# EAGLE schematic gdo_v7 (EAGLE 9.5.2)
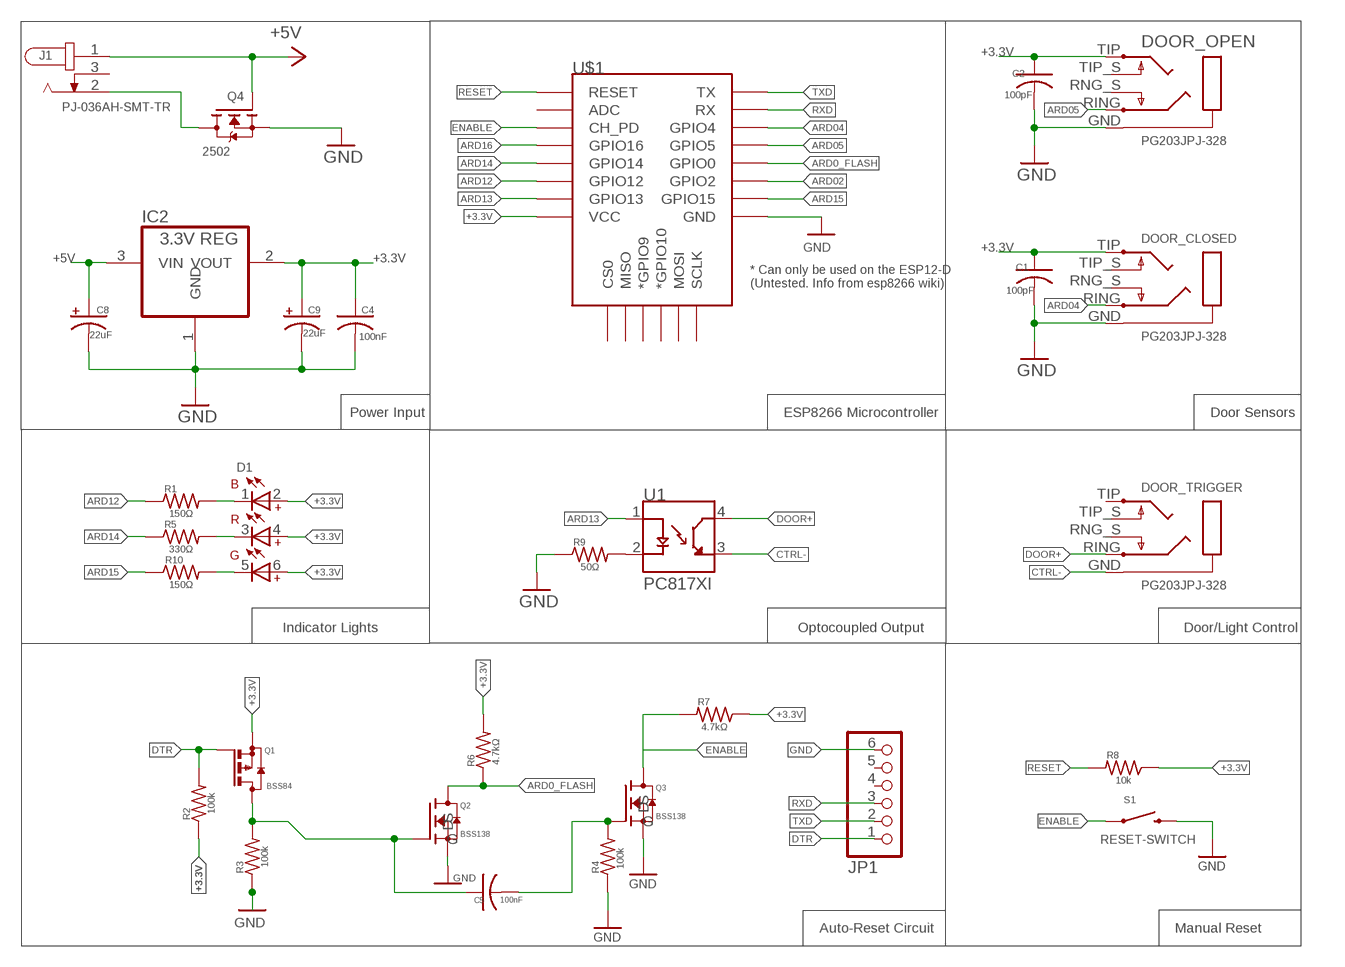
[diagram p0: schematic, sheet 1]

## Parts
C1  100pF  C-USC0805  [C0805]
C2  100pF  C-USC0805  [C0805]
C4  100nF  C-USC0805  [C0805]
C5  100nF  C-USC0805  [C0805]
C8  22uF  10UF-TANT  [EIA3216]
C9  22uF  10UF-TANT  [EIA3216]
D1  WL-SFTW_5050_PLCC6_150505M173300  [WL-SFTW_5050_PLCC6]
DOOR_CLOSED  PG203JPJ-328  [PG203J]
DOOR_OPEN  PG203JPJ-328  [PG203J]
DOOR_TRIGGER  PG203JPJ-328  [PG203J]
IC2  3.3V REG  REG1117  [SOT223]
J1  PJ-036AH-SMT-TR  [CUI_PJ-036AH-SMT-TR]
JP1  PINHD-1X6  [1X06]
Q1  BSS84  [SOT23]
Q2  BSS138  [BSS138]
Q3  BSS138  [BSS138]
Q4  2502  BSS138  [SOT23]
R1  150Ω  R-US_R0805  [R0805]
R2  100k  R-US_R0805  [R0805]
R3  100k  R-US_R0805  [R0805]
R4  100k  R-US_R0805  [R0805]
R5  330Ω  R-US_R0805  [R0805]
R6  4.7kΩ  R-US_R0805  [R0805]
R7  4.7kΩ  R-US_R0805  [R0805]
R8  10k  R-US_R0805  [R0805]
R9  50Ω  R-US_R0805  [R0805]
R10  150Ω  R-US_R0805  [R0805]
S1  RESET-SWITCH  SWITCH-MOMENTARY-2-SMD-1101NE  [TACTILE-SWITCH-1101NE]
U1  PC817XI  [SOIC254P975X460-4N]
U$1  ESP12ESMD  [ESP12E-SMD]

## Nets
+3.3V: C1.1 C2.1 C4.1 C9.A(+) D1.2 D1.4 D1.6 DOOR_CLOSED.TIP DOOR_OPEN.TIP IC2.2(VOUT) Q1.2(S) R2.1 R6.2 R7.1 R8.1 U$1.VCC
+5V: C8.A(+) IC2.3(VIN) J1.1 Q4.1(G)
ARD0_FLASH: Q2.D R6.1 U$1.GPIO0
ARD02: U$1.GPIO2
ARD04: DOOR_CLOSED.RING U$1.GPIO4
ARD05: DOOR_OPEN.RING U$1.GPIO5
ARD12: R1.1 U$1.GPIO12
ARD13: U1.1(A) U$1.GPIO13
ARD14: R5.1 U$1.GPIO14
ARD15: R10.1 U$1.GPIO15
ARD16: U$1.GPIO16
CTRL-: DOOR_TRIGGER.GND U1.3(ET)
DOOR+: DOOR_TRIGGER.RING U1.4(CT)
DTR: JP1.1 Q1.1(G) R2.2
ENABLE: Q3.D R7.2 S1.P$1 U$1.CH_PD
GND: C1.2 C2.2 C4.2 C8.C(-) C9.C(-) DOOR_CLOSED.GND DOOR_OPEN.GND IC2.1(GND) JP1.6 Q2.S Q3.S Q4.2(S) R3.1 R4.1 R9.1 S1.P$2 U$1.GND
N$1: J1.2 Q4.3(D)
N$2: C5.2 Q3.G R4.2
N$3: D1.1 R1.2
N$4: D1.3 R5.2
N$5: C5.1 Q1.3(D) Q2.G R3.2
N$6: R9.2 U1.2(C)
N$7: D1.5 R10.2
RESET: R8.2 U$1.RESET
RXD: JP1.3 U$1.RXD0(RX)
TXD: JP1.2 U$1.TXD0(TX)
Unconnected: DOOR_CLOSED.RNG_S DOOR_CLOSED.TIP_S DOOR_OPEN.RNG_S DOOR_OPEN.TIP_S DOOR_TRIGGER.RNG_S DOOR_TRIGGER.TIP DOOR_TRIGGER.TIP_S J1.3 JP1.4 JP1.5 U$1.ADC U$1.CS0 U$1.GPIO9(*GPIO9) U$1.GPIO10(*GPIO10) U$1.MISO U$1.MOSI U$1.SCLK

## Notes on the sheet
- Power Input | ESP8266 Microcontroller | Door Sensors
- Indicator Lights | Optocoupled Output | Door/Light Control
- Auto-Reset Circuit | Manual Reset

## Library data of the parts
C1 C2 C4 C5 = resistor:C-US: CAPACITOR, American symbol
C8 C9 = SparkFun-Capacitors:10UF-TANT: 10uF Tantalum SMT CAP-00811- 16V 10% (EIA-3216); PROD_ID: CAP-00811; VALUE: 10uF
D1 = Eagle_WL-SFTW_rev19c:WL-SFTW_5050_PLCC6: WL-SFTW SMD Full-color TOP LED Waterclear Characteristics PLCC 4, PLCC 6 Low energy consumption High reliability Low current requirement Fast switching No UV/IR radiation High brightness RGB individual control Compact package outline PLCC 4: black surface PLCC 6: white surface Applications PLCC 4: Size 3528 Flash light, switch indicators, equipments indicators, accent and decorative lighting, electronic signage, video displays, backlight for LCDs, PDAs and TVs, vven, microwave, street lighting, ideal for lateral coupling in light guides PLCC 6: Size 3528 TV backlighting, color splashing walls, accent and decorative lighting, optical indicator and RGB LEDs strips PLCC 6: Size 5050 Optical indicator, equipments indicators, electronic signage, interior lighting, wide range of accent and decorative lighting, full color message and displays video boards, consumer appliances: backlight LCDs, PDAs, TVs, industry white goods such as ovens, microwaves, etc. and RGB LEDs strips <https://katalog.we-online.com/media/images/v2/o14903v209%20Family_WL-SFTW-neu.jpg> Details see: https://katalog.we-online.com/en/led/WL-SFTW Created By Ella Wu 2019-06-10 2018 (C) Wurth Elektronik; WE-NUMBER: 150505M173300
DOOR_CLOSED DOOR_OPEN DOOR_TRIGGER = PJ-328 Jack:PG203J: 3.5mm Mic/Headphone Jack Stereo microphone/headphone jack PJ-328
IC2 = burr-brown:REG1117: 800mA and 1A Low Dropout (LDO) Positive Regulator 1.8V, 2.5V, 2.85V, 3.3V, 5V, and Adj; MPN: REG1117; OC_FARNELL: 1097566; OC_NEWARK: 14P6981
J1 = PJ-036AH-SMT-TR:PJ-036AH-SMT-TR: 2.0 mm Center Pin, 5.0 A, Right Angle, Surface Mount (SMT), Dc Power Jack Connector; AVAILABILITY: Unavailable; CUI_PURCHASE_URL: https://www.cuidevices.com/product/interconnect/connectors/dc-power-connectors/jacks/pj-036ah-smt-tr?utm_source=snapeda.com&utm_medium=referral&utm_campaign=snapedaBOM; DESCRIPTION: 2.0 x 6.3 mm, 5.0 A, Horizontal, Surface Mount _SMT_, Dc Power Jack Connector; MF: CUI Devices; MP: PJ-036AH-SMT-TR; PACKAGE: None; PRICE: None
JP1 = adafruit:PINHD-1X6: PIN HEADER
Q1 = transistor-small-signal:BSS84: P-CHANNEL MOS FET
Q2 Q3 = Ava:BSS138: BSS138 N-Channel Logic Level Enhancement Mode Field Effect Transistor Source: http://www.fairchildsemi.com/datasheets/BS/BSS138.pdf
Q4 = bss138_10:BSS138: BSS138 N-Channel Logic Level Enhancement Mode Field Effect Transistor Source: http://www.fairchildsemi.com/datasheets/BS/BSS138.pdf; MF: Fairchild; MPN: BSS138; OC_FARNELL: 9845330; OC_NEWARK: 67R2009
R1-R10 = resistor:R-US_: RESISTOR, American symbol
S1 = SparkFun-Electromechanical:SWITCH-MOMENTARY-2: Various NO switches- pushbuttons, reed, etc
U1 = PC817XI:PC817XI: Semiconductors and Actives, Optocouplers/Optoisolators, trans, Optoelectronics, smd; AVAILABILITY: Unavailable; DESCRIPTION: Optoisolator Transistor Output 5000Vrms 1 Channel 4-SMD; MF: Sharp Microelectronics; MP: PC817XI; PACKAGE: SMD-4 Sharp; PRICE: None
U$1 = esp8266modules:ESP12E: ESP12E Module